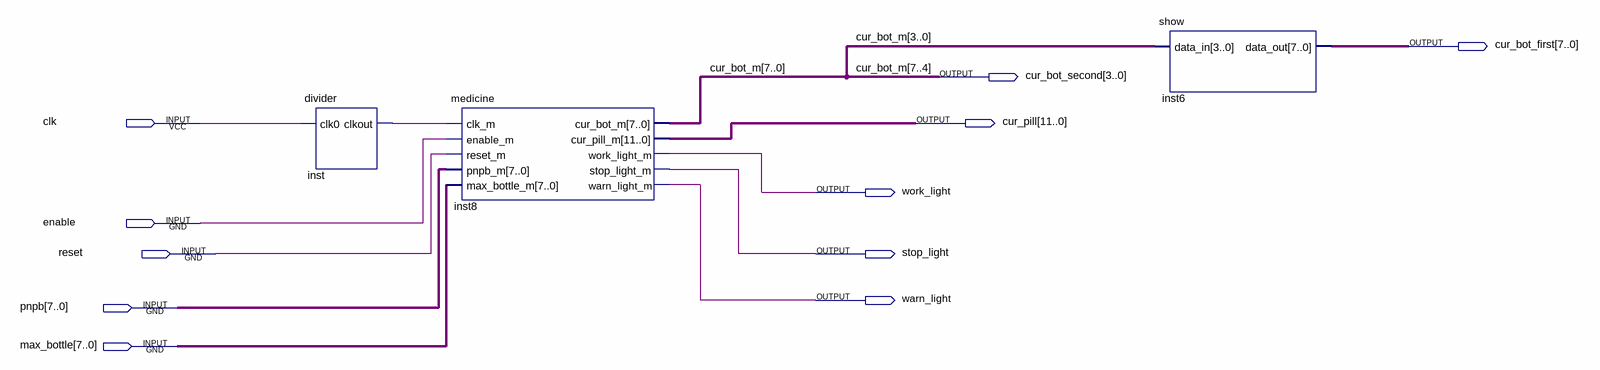
[diagram p0: schematic sheet]
// Quartus schematic total1.bdf as structural Verilog: 3 symbols, 11 pins
module total1 (
  input  clk,
  input  enable,
  input  reset,
  input  [7:0] pnpb,
  input  [7:0] max_bottle,
  output [7:0] cur_bot_first,
  output [3:0] cur_bot_second,
  output [11:0] cur_pill,
  output work_light,
  output stop_light,
  output warn_light
);

  wire inst_clkout;
  wire [3:0] cur_bot_m;

  divider inst (.clk0(clk), .clkout(inst_clkout));
  medicine inst8 (
    .clk_m(inst_clkout), .enable_m(enable), .reset_m(reset), .pnpb_m(pnpb), .max_bottle_m(max_bottle),
    .cur_bot_m({cur_bot_second, cur_bot_m}), .cur_pill_m(cur_pill), .work_light_m(work_light),
    .stop_light_m(stop_light), .warn_light_m(warn_light));
  show inst6 (.data_in(cur_bot_m), .data_out(cur_bot_first));

  // Other names for the same wires on the sheet: cur_bot_m[7:4] = cur_bot_second
endmodule
